# Altium schematic sheet micro-sd-wing.SchDoc: Posedge Micro-SD Wing
size A4; Organization: www.posedge.ir; Address1: TORANJ Inc.; Address2: Isfahan Science and; Address3: Technology Town, Isfahan; Address4: IRAN
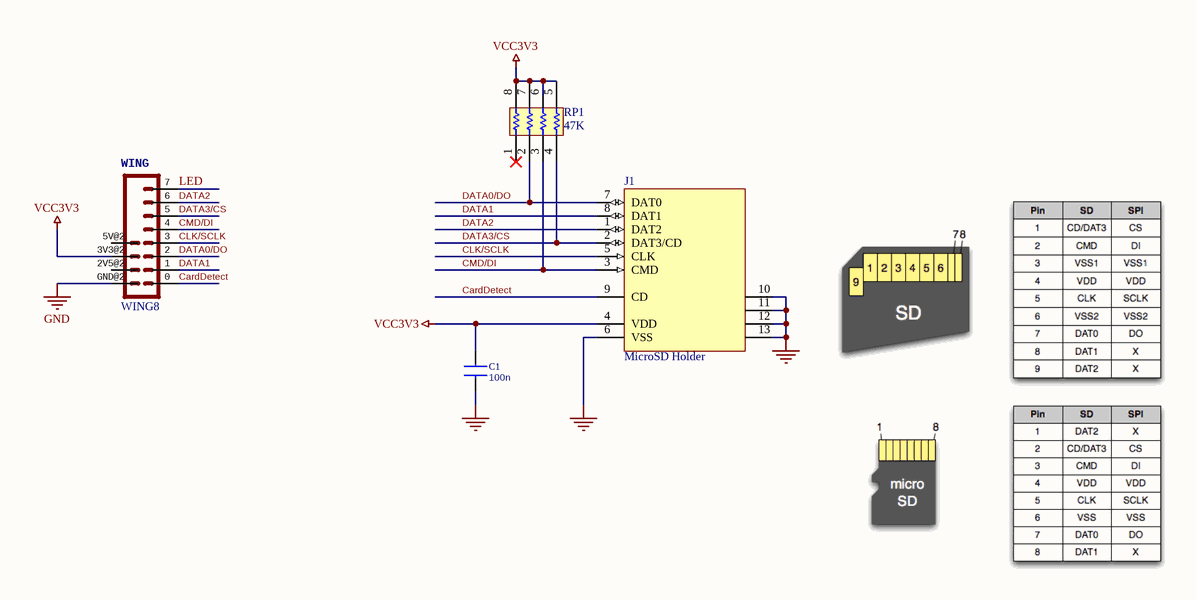
[diagram p0: micro-sd-wing.SchDoc]

## Parts
C1  100n  [C0805_M]
J1  MicroSD Holder  [micro sd soket]
RP1  47K  [RESCAXS50P160X320X70-8N]
WING  WING8  [WINGSIDE_8BIT]

## Nets
GND: C1.1 J1.6(VSS) J1.10 J1.11 J1.12 J1.13 WING.GND@2(GND)
VCC3V3: C1.2 J1.4(VDD) RP1.5 RP1.6 RP1.7 RP1.8 WING.3V3@2(3V3)
CardDetect: J1.9(CD) WING.0
CLK/SCLK: J1.5(CLK) WING.3
CMD/DI: J1.3(CMD) RP1.3 WING.4
DATA0/DO: J1.7(DAT0) RP1.2 WING.2
DATA1: J1.8(DAT1) WING.1
DATA2: J1.1(DAT2) WING.6
DATA3/CS: J1.2(DAT3/CD) RP1.4 WING.5
LED: WING.7

Not connected (* = marked no-connect by the designer): RP1 1*; WING 2V5@2(2V5) 5V@2(5V)

## Notes on the sheet
- Title
- Size:
- Date:
- A4
- Number:
- Revision:
- Sheet
- of

## Library data of the parts
C1 = C0805: Ceramic Capactor size 0805; Supplier: *; Value: 100n
J1 = MicroSD: MicroSD Memory Card Holder
RP1 = RESPACK_4X: Isolated Resistor Network; Value: 47K